# Altium project mini-DIN-Nucleo-32-adapter-board.PrjPcb
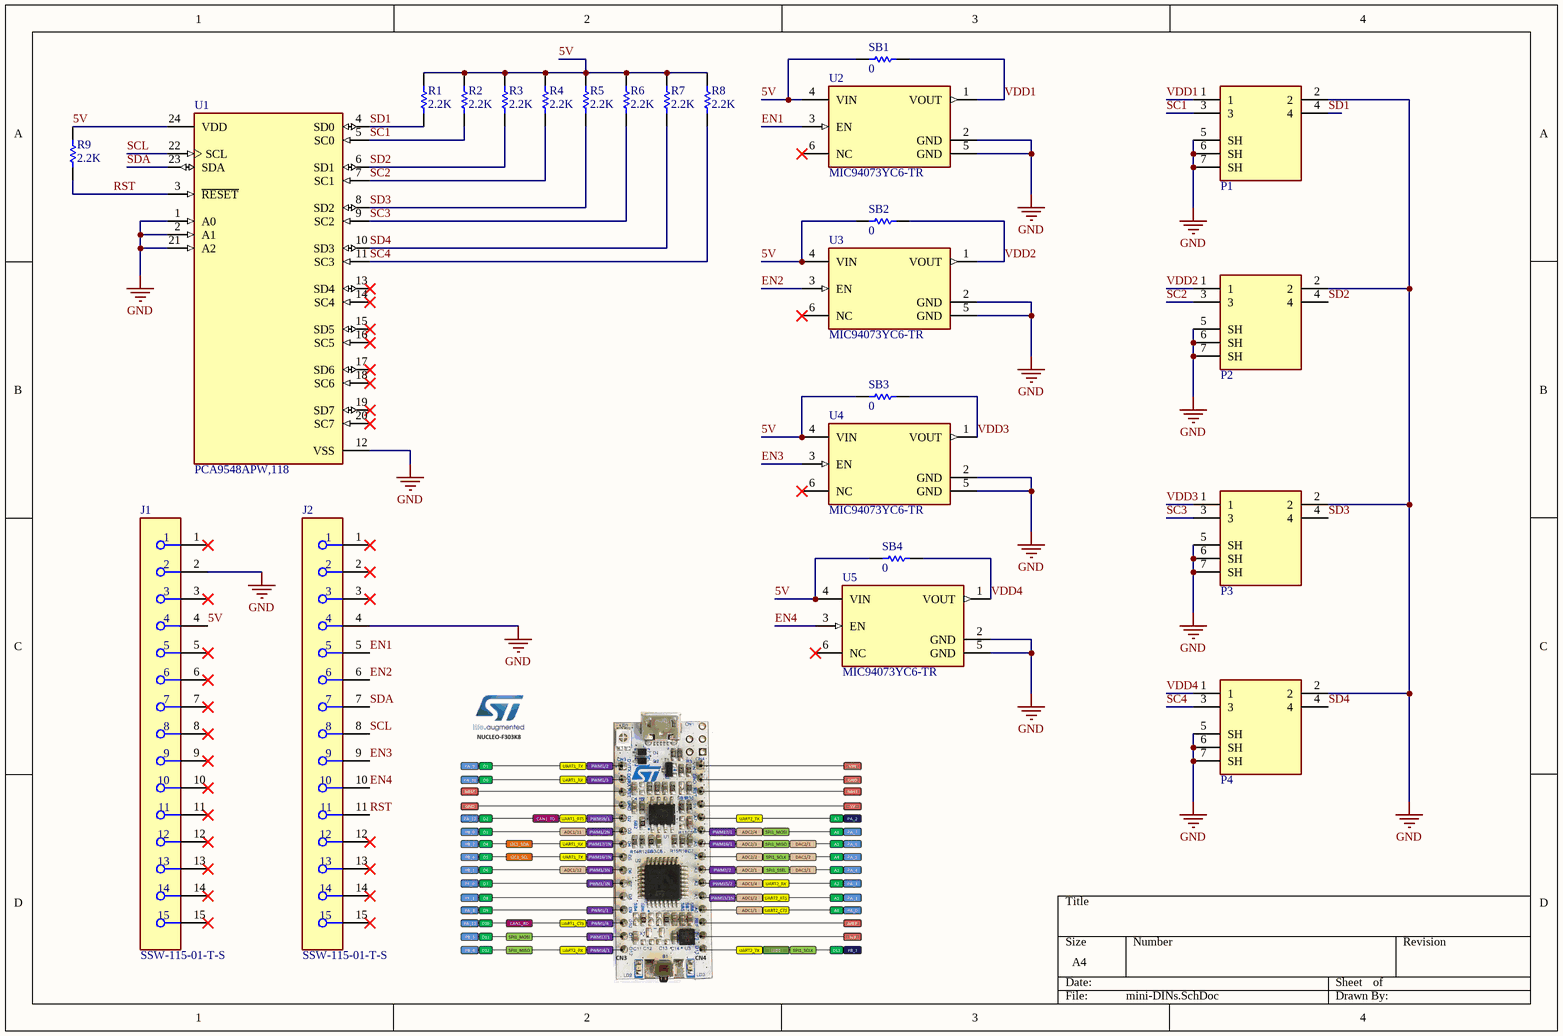
[diagram p0: mini-DINs.SchDoc]
1 sheet, 24 parts. Net scope: global (net labels, ports and power ports of the same name join across sheets).
Board file: PCB1.PcbDoc

## Sheet mini-DINs.SchDoc
size A4; SheetNumber: 1; SheetTotal: 1

### Parts
J1  SSW-115-01-T-S  [FP-SSW-115-01-T-S-MFG]
J2  SSW-115-01-T-S  [FP-SSW-115-01-T-S-MFG]
P1  mini-DIN-connector  [TE_5749181-1]  (value not drawn)
P2  mini-DIN-connector  [TE_5749181-1]  (value not drawn)
P3  mini-DIN-connector  [TE_5749181-1]  (value not drawn)
P4  mini-DIN-connector  [TE_5749181-1]  (value not drawn)
R1  2.2K  [RESC1608X55X25ML10T15]
R2  2.2K  [RESC1608X55X25ML10T15]
R3  2.2K  [RESC1608X55X25ML10T15]
R4  2.2K  [RESC1608X55X25ML10T15]
R5  2.2K  [RESC1608X55X25ML10T15]
R6  2.2K  [RESC1608X55X25ML10T15]
R7  2.2K  [RESC1608X55X25ML10T15]
R8  2.2K  [RESC1608X55X25ML10T15]
R9  2.2K  [RESC1608X55X25ML10T15]
SB1  0  [RESC1608X55X25ML10T15]
SB2  0  [RESC1608X55X25ML10T15]
SB3  0  [RESC1608X55X25ML10T15]
SB4  0  [RESC1608X55X25ML10T15]
U1  PCA9548APW,118  [FP-SOT355-1-MFG]
U2  MIC94073YC6-TR  [FP-SC70-6LD-PL-1-IPC_B]
U3  MIC94073YC6-TR  [FP-SC70-6LD-PL-1-IPC_B]
U4  MIC94073YC6-TR  [FP-SC70-6LD-PL-1-IPC_B]
U5  MIC94073YC6-TR  [FP-SC70-6LD-PL-1-IPC_B]

### Nets
GND: J1.2 J2.4 P1.2 P1.5(SH) P1.6(SH) P1.7(SH) P2.2 P2.5(SH) P2.6(SH) P2.7(SH) P3.2 P3.5(SH) P3.6(SH) P3.7(SH) P4.2 P4.5(SH) P4.6(SH) P4.7(SH) U1.1(A0) U1.2(A1) U1.12(VSS) U1.21(A2) U2.2(GND) U2.5(GND) U3.2(GND) U3.5(GND) U4.2(GND) U4.5(GND) U5.2(GND) U5.5(GND)
5V: J1.4 R1.2 R2.2 R3.2 R4.2 R5.2 R6.2 R7.2 R8.2 R9.2 SB1.2 SB2.2 SB3.2 SB4.2 U1.24(VDD) U2.4(VIN) U3.4(VIN) U4.4(VIN) U5.4(VIN)
EN1: J2.5 U2.3(EN)
EN2: J2.6 U3.3(EN)
EN3: J2.9 U4.3(EN)
EN4: J2.10 U5.3(EN)
RST: J2.11 R9.1 U1.3(~{RESET})
SC1: P1.3 R2.1 U1.5(SC0)
SC2: P2.3 R4.1 U1.7(SC1)
SC3: P3.3 R6.1 U1.9(SC2)
SC4: P4.3 R8.1 U1.11(SC3)
SCL: J2.8 U1.22(SCL)
SD1: P1.4 R1.1 U1.4(SD0)
SD2: P2.4 R3.1 U1.6(SD1)
SD3: P3.4 R5.1 U1.8(SD2)
SD4: P4.4 R7.1 U1.10(SD3)
SDA: J2.7 U1.23(SDA)
VDD1: P1.1 SB1.1 U2.1(VOUT)
VDD2: P2.1 SB2.1 U3.1(VOUT)
VDD3: P3.1 SB3.1 U4.1(VOUT)
VDD4: P4.1 SB4.1 U5.1(VOUT)

Not connected (* = marked no-connect by the designer): J1 1* 3* 5* 6* 7* 8* 9* 10* 11* 12* 13* 14* 15*; J2 1* 2* 3* 12* 13* 14* 15*; U1 13(SD4)* 14(SC4)* 15(SD5)* 16(SC5)* 17(SD6)* 18(SC6)* 19(SD7)* 20(SC7)*; U2 6(NC)*; U3 6(NC)*; U4 6(NC)*; U5 6(NC)*

### Library data of the parts
J1 J2 = CMP-02766-001723-1: CONN RCPT 15POS 0.1 TIN PCB; Connector Type: Receptacle; Max Voltage Rating (AC): 550V; Mating Cycles: 100; Number of Positions: 15; Pitch: 0.1inch; Max Current Rating: 6.9A; Contact Resistance: 10mR; Contact Type: Female Socket; Color: Black; Depth: 2.41mm; Radiation Hardening: No; Orientation: Straight; Termination: Solder; Series: SSW; Lead Free: Lead Free; Min Operating Temperature: -55°C; Contact Plating: Tin; Contact Material: Bronze; Max Operating Temperature: 105°C; Mount: Through Hole; Packaging: Bulk; Gender: Receptacle; Housing Material: Polymer; RoHS Compliant: Yes; Length: 38.61mm; Number of Rows: 1; REACH SVHC: No SVHC; Width: 2.41mm; Number of Contacts: 15; Housing Color: Black
P1-P4 = mini-DIN-connector: https://dk.rs-online.com/web/p/din-stik/1644205?gb=s
R1-R9 SB1-SB4 = CMP-2100-03667-1: Chip Resistor, 0 Ohm, +/- 5%, 0.1 W, -55 to 155 degC, 0603 (1608 Metric), RoHS, Tape and Reel; Manufacturer: Yageo; Temperature Coefficient: 200ppm/degreesC; Voltage Rating: 50V; Power Rating: 100mW; Width: 0.8mm; Max Operating Temperature: 155degC; Tolerance: 5%; Package Reference: 0603; Height: 0.45mm; Depth: 0.8mm; Package Description: 2-Pin Surface Mount Device, Body 1.6 x 0.8 mm; Termination: SMD/SMT; Package Quantity: 5000; Case/Package: 0603; Case Code (Imperial): 0603; Radiation Hardening: No; Number of Pins: 2; Length: 1.6mm; Lead Free: LeadFree; Voltage Rating (DC): 50V; Military Standard: Not; Datasheet URL: http://www.yageo.com/NewPortal/yageodocoutput?fileName=/pdf/R-Chip/PYu-RC_Group_51_RoHS_L_5.pdf; Manufacturer URL: http://www.yageo.com/; Packaging: TapeandReel; Case Code (Metric): 1608; Min Operating Temperature: -55degC; Composition: ThickFilm; RoHSCompliant: true; Contact Plating: Tin; Datasheet Version: Rev. 5, 10/2016; REACH SVHC: NoSVHC
  R1-R9: Resistance: 2.2K
  SB1-SB4: Resistance: 0
U1 = CMP-2000-06880-2: IC INTERFACE SPECIALIZED 24TSSOP; Power Dissipation: 400mW; Low Level Output Current: 9mA; Number of Channels: 16; Max Frequency: 400kHz; Number of Inputs: 8; Number of Outputs: 1; On-State Resistance: 24R; Interface: I2C; Turn-On Delay Time: 300ns; Logic Function: Multiplexer; Nominal Supply Current: 100mA; Operating Supply Current: 65uA; Min Supply Voltage: 2.3V; Propagation Delay: 0.3ns; Max Supply Voltage: 5.5V; Contact Plating: Gold; Max Power Dissipation: 400mW; Mount: Surface Mount; Package Quantity: 2500; Min Operating Temperature: -40°C; Max Operating Temperature: 85°C; Case/Package: TSSOP; Number of Pins: 24; Bandwidth: 400kHz; Quiescent Current: 65uA; Packaging: Tape and Reel; Lead Free: Lead Free; Turn-Off Delay Time: 300ns; Radiation Hardening: No
U2-U5 = CMP-06320-000041-1: IC PWR SWITCH P-CHAN 1:1 SC70-6; Output Current: 1.2A; Interface: On/Off; On-State Resistance: 120mR; Number of Outputs: 1; Voltage: 5.5V; Output Configuration: High Side; On-state Resistance-Max: 170MR; Packaging: Tape and Reel; Series: -; Reach SVHC Compliant: Yes; Max Output Current: 1.2A; RoHS Compliant: Yes; Mount: Surface Mount; Length: 2.2mm; Current Rating: 1.2A; Case/Package: SC; Current: 1.2A; Min Operating Temperature: -40°C; Max Operating Temperature: 125°C; Package Quantity: 3000; Height: 1mm; Width: 1.35mm; Rated Current-Max: 1.2A; Lead Free: Lead Free; Number of Pins: 6